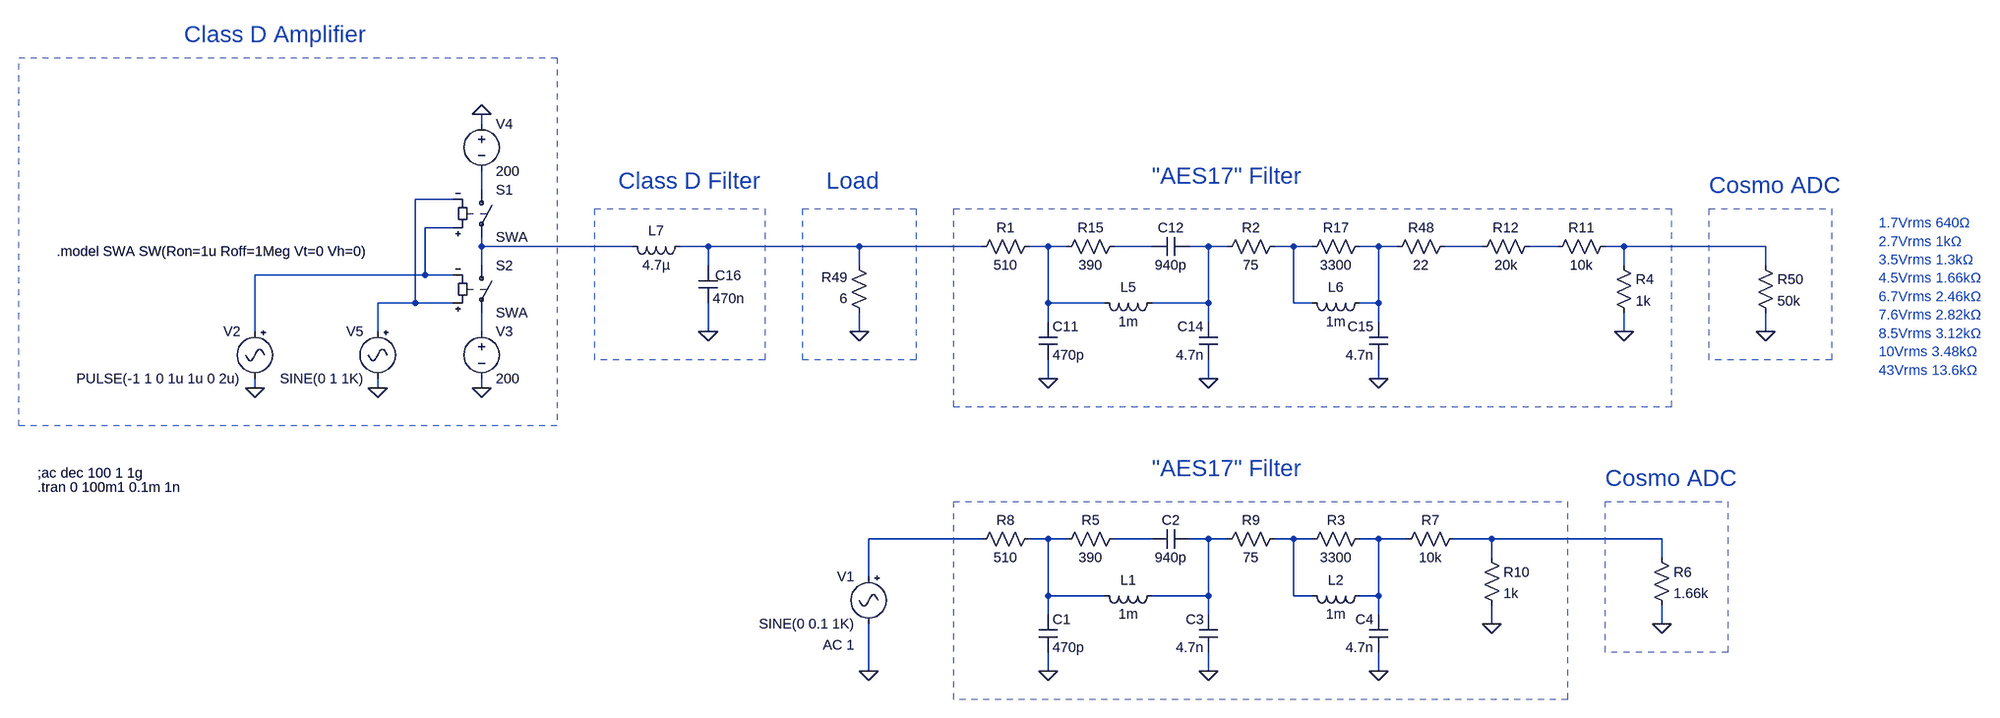
[diagram p0: schematic AES17Filter new only.asc]
AES17Filter new only.asc, the LTspice schematic file:
Version 4
SHEET 1 2936 680
WIRE -400 -1120 -400 -1136
WIRE -400 -1008 -400 -1040
WIRE -448 -992 -512 -992
WIRE -448 -944 -496 -944
WIRE -400 -912 -400 -928
WIRE -144 -912 -400 -912
WIRE -16 -912 -64 -912
WIRE 240 -912 -16 -912
WIRE 448 -912 240 -912
WIRE 560 -912 528 -912
WIRE 592 -912 560 -912
WIRE 736 -912 672 -912
WIRE 832 -912 800 -912
WIRE 864 -912 832 -912
WIRE 976 -912 944 -912
WIRE 1008 -912 976 -912
WIRE 1120 -912 1088 -912
WIRE 1152 -912 1120 -912
WIRE 1296 -912 1232 -912
WIRE 1424 -912 1376 -912
WIRE 1536 -912 1504 -912
WIRE 1776 -912 1536 -912
WIRE -400 -880 -400 -912
WIRE -16 -880 -16 -912
WIRE 240 -880 240 -912
WIRE 1536 -880 1536 -912
WIRE 1776 -880 1776 -912
WIRE -496 -864 -496 -944
WIRE -496 -864 -784 -864
WIRE -448 -864 -496 -864
WIRE -512 -816 -512 -992
WIRE -512 -816 -576 -816
WIRE -448 -816 -512 -816
WIRE 560 -816 560 -912
WIRE 656 -816 560 -816
WIRE 832 -816 832 -912
WIRE 832 -816 736 -816
WIRE 976 -816 976 -912
WIRE 1008 -816 976 -816
WIRE 1120 -816 1120 -912
WIRE 1120 -816 1088 -816
WIRE 560 -784 560 -816
WIRE 832 -784 832 -816
WIRE 1120 -784 1120 -816
WIRE -784 -768 -784 -864
WIRE -576 -768 -576 -816
WIRE -400 -768 -400 -800
WIRE -16 -768 -16 -816
WIRE 240 -768 240 -800
WIRE 1536 -768 1536 -800
WIRE 1776 -768 1776 -800
WIRE 560 -688 560 -720
WIRE 832 -688 832 -720
WIRE 1120 -688 1120 -720
WIRE -784 -672 -784 -688
WIRE -576 -672 -576 -688
WIRE -400 -672 -400 -688
WIRE 448 -416 256 -416
WIRE 560 -416 528 -416
WIRE 592 -416 560 -416
WIRE 736 -416 672 -416
WIRE 832 -416 800 -416
WIRE 864 -416 832 -416
WIRE 976 -416 944 -416
WIRE 1008 -416 976 -416
WIRE 1120 -416 1088 -416
WIRE 1168 -416 1120 -416
WIRE 1312 -416 1248 -416
WIRE 1600 -416 1312 -416
WIRE 1312 -384 1312 -416
WIRE 1600 -384 1600 -416
WIRE 256 -352 256 -416
WIRE 560 -320 560 -416
WIRE 656 -320 560 -320
WIRE 832 -320 832 -416
WIRE 832 -320 736 -320
WIRE 976 -320 976 -416
WIRE 1008 -320 976 -320
WIRE 1120 -320 1120 -416
WIRE 1120 -320 1088 -320
WIRE 560 -288 560 -320
WIRE 832 -288 832 -320
WIRE 1120 -288 1120 -320
WIRE 1312 -272 1312 -304
WIRE 1600 -272 1600 -304
WIRE 256 -192 256 -272
WIRE 560 -192 560 -224
WIRE 832 -192 832 -224
WIRE 1120 -192 1120 -224
FLAG 560 -688 0
FLAG 832 -688 0
FLAG 1120 -688 0
FLAG -400 -672 0
FLAG -400 -1136 0
FLAG -576 -672 0
FLAG -784 -672 0
FLAG -16 -768 0
FLAG 240 -768 0
FLAG 1776 -768 0
FLAG 1536 -768 0
FLAG 560 -192 0
FLAG 832 -192 0
FLAG 1120 -192 0
FLAG 1600 -272 0
FLAG 1312 -272 0
FLAG 256 -192 0
SYMBOL cap 544 -784 R0
SYMATTR InstName C11
SYMATTR Value 470p
SYMBOL cap 800 -928 R90
WINDOW 0 0 32 VBottom 2
WINDOW 3 32 32 VTop 2
SYMATTR InstName C12
SYMATTR Value 940p
SYMBOL ind 752 -832 R90
WINDOW 0 5 56 VBottom 2
WINDOW 3 32 56 VTop 2
SYMATTR InstName L5
SYMATTR Value 1m
SYMATTR SpiceLine Rser=1.4
SYMBOL cap 848 -720 R180
WINDOW 0 24 56 Left 2
WINDOW 3 24 8 Left 2
SYMATTR InstName C14
SYMATTR Value 4.7n
SYMBOL res 1104 -928 R90
WINDOW 0 0 56 VBottom 2
WINDOW 3 32 56 VTop 2
SYMATTR InstName R17
SYMATTR Value 3300
SYMBOL ind 1104 -832 R90
WINDOW 0 5 56 VBottom 2
WINDOW 3 32 56 VTop 2
SYMATTR InstName L6
SYMATTR Value 1m
SYMATTR SpiceLine Rser=1.4
SYMBOL cap 1136 -720 R180
WINDOW 0 24 56 Left 2
WINDOW 3 24 8 Left 2
SYMATTR InstName C15
SYMATTR Value 4.7n
SYMBOL res 688 -928 R90
WINDOW 0 0 56 VBottom 2
WINDOW 3 32 56 VTop 2
SYMATTR InstName R15
SYMATTR Value 390
SYMBOL sw -400 -1024 R0
SYMATTR InstName S1
SYMATTR Value SWA
SYMBOL sw -400 -896 R0
SYMATTR InstName S2
SYMATTR Value SWA
SYMBOL voltage -400 -784 R0
WINDOW 123 0 0 Left 0
WINDOW 39 0 0 Left 0
SYMATTR InstName V3
SYMATTR Value 200
SYMBOL voltage -400 -1136 R0
WINDOW 123 0 0 Left 0
WINDOW 39 0 0 Left 0
SYMATTR InstName V4
SYMATTR Value 200
SYMBOL Misc\\signal -784 -784 M0
WINDOW 123 24 132 Left 2
WINDOW 39 0 0 Left 0
SYMATTR InstName V2
SYMATTR Value PULSE(-1 1 0 1u 1u 0 2u)
SYMBOL Misc\\signal -576 -784 M0
WINDOW 123 24 132 Left 2
WINDOW 39 0 0 Left 0
SYMATTR InstName V5
SYMBOL ind -48 -928 R90
WINDOW 0 5 56 VBottom 2
WINDOW 3 32 56 VTop 2
SYMATTR InstName L7
SYMATTR Value 4.7µ
SYMATTR SpiceLine Rser=1m
SYMBOL cap -32 -880 R0
WINDOW 0 28 17 Left 2
SYMATTR InstName C16
SYMATTR Value 470n
SYMBOL res 256 -784 R180
WINDOW 0 36 76 Left 2
WINDOW 3 36 40 Left 2
SYMATTR InstName R49
SYMATTR Value 6
SYMBOL res 1760 -896 R0
SYMATTR InstName R50
SYMATTR Value 50k
SYMBOL res 1248 -928 R90
WINDOW 0 0 56 VBottom 2
WINDOW 3 32 56 VTop 2
SYMATTR InstName R48
SYMATTR Value 22
SYMBOL res 544 -928 R90
WINDOW 0 0 56 VBottom 2
WINDOW 3 32 56 VTop 2
SYMATTR InstName R1
SYMATTR Value 510
SYMBOL res 960 -928 R90
WINDOW 0 0 56 VBottom 2
WINDOW 3 32 56 VTop 2
SYMATTR InstName R2
SYMATTR Value 75
SYMBOL res 1520 -896 R0
SYMATTR InstName R4
SYMATTR Value 1k
SYMBOL cap 544 -288 R0
SYMATTR InstName C1
SYMATTR Value 470p
SYMBOL cap 800 -432 R90
WINDOW 0 0 32 VBottom 2
WINDOW 3 32 32 VTop 2
SYMATTR InstName C2
SYMATTR Value 940p
SYMBOL ind 752 -336 R90
WINDOW 0 5 56 VBottom 2
WINDOW 3 32 56 VTop 2
SYMATTR InstName L1
SYMATTR Value 1m
SYMATTR SpiceLine Rser=1.4
SYMBOL cap 848 -224 R180
WINDOW 0 24 56 Left 2
WINDOW 3 24 8 Left 2
SYMATTR InstName C3
SYMATTR Value 4.7n
SYMBOL res 1104 -432 R90
WINDOW 0 0 56 VBottom 2
WINDOW 3 32 56 VTop 2
SYMATTR InstName R3
SYMATTR Value 3300
SYMBOL ind 1104 -336 R90
WINDOW 0 5 56 VBottom 2
WINDOW 3 32 56 VTop 2
SYMATTR InstName L2
SYMATTR Value 1m
SYMATTR SpiceLine Rser=1.4
SYMBOL cap 1136 -224 R180
WINDOW 0 24 56 Left 2
WINDOW 3 24 8 Left 2
SYMATTR InstName C4
SYMATTR Value 4.7n
SYMBOL res 688 -432 R90
WINDOW 0 0 56 VBottom 2
WINDOW 3 32 56 VTop 2
SYMATTR InstName R5
SYMATTR Value 390
SYMBOL res 1584 -400 R0
SYMATTR InstName R6
SYMATTR Value 1.66k
SYMBOL res 1264 -432 R90
WINDOW 0 0 56 VBottom 2
WINDOW 3 32 56 VTop 2
SYMATTR InstName R7
SYMATTR Value 10k
SYMBOL res 544 -432 R90
WINDOW 0 0 56 VBottom 2
WINDOW 3 32 56 VTop 2
SYMATTR InstName R8
SYMATTR Value 510
SYMBOL res 960 -432 R90
WINDOW 0 0 56 VBottom 2
WINDOW 3 32 56 VTop 2
SYMATTR InstName R9
SYMATTR Value 75
SYMBOL res 1296 -400 R0
SYMATTR InstName R10
SYMATTR Value 1k
SYMBOL Misc\\signal 256 -368 M0
WINDOW 123 24 132 Left 2
WINDOW 39 0 0 Left 0
SYMATTR Value2 AC 1
SYMATTR InstName V1
SYMATTR Value SINE(0 0.1 1K)
SYMBOL res 1520 -928 R90
WINDOW 0 0 56 VBottom 2
WINDOW 3 32 56 VTop 2
SYMATTR InstName R11
SYMATTR Value 10k
SYMBOL res 1392 -928 R90
WINDOW 0 0 56 VBottom 2
WINDOW 3 32 56 VTop 2
SYMATTR InstName R12
SYMATTR Value 20k
TEXT -1152 -528 Left 2 !;ac dec 100 1 1g
TEXT -1152 -504 Left 2 !.tran 0 100m1 0.1m 1n
TEXT -1120 -904 Left 2 !.model SWA SW(Ron=1u Roff=1Meg Vt=0 Vh=0)
TEXT -904 -1272 Left 4 ;Class D Amplifier
TEXT -168 -1024 Left 4 ;Class D Filter
TEXT 184 -1024 Left 4 ;Load
TEXT 736 -1032 Left 4 ;"AES17" Filter
TEXT 1680 -1016 Left 4 ;Cosmo ADC
TEXT 1968 -952 Left 2 ;1.7Vrms 640Ω\n2.7Vrms 1kΩ\n3.5Vrms 1.3kΩ\n4.5Vrms 1.66kΩ\n6.7Vrms 2.46kΩ\n7.6Vrms 2.82kΩ\n8.5Vrms 3.12kΩ\n10Vrms 3.48kΩ\n43Vrms 13.6kΩ
TEXT 736 -536 Left 4 ;"AES17" Filter
TEXT 1504 -520 Left 4 ;Cosmo ADC
RECTANGLE Normal -272 -608 -1184 -1232 2
RECTANGLE Normal 80 -720 -208 -976 2
RECTANGLE Normal 336 -720 144 -976 2
RECTANGLE Normal 1616 -640 400 -976 2
RECTANGLE Normal 1888 -720 1680 -976 2
RECTANGLE Normal 1440 -144 400 -480 2
RECTANGLE Normal 1712 -224 1504 -480 2

The netlist it stands for:
* AES17Filter new only.asc
C11 N006 0 470p
C12 N008 N007 940p
L5 N008 N006 1m Rser=1.4
C14 0 N008 4.7n
R17 N010 N009 3300
L6 N010 N009 1m Rser=1.4
C15 0 N010 4.7n
R15 N007 N006 390
S1 N001 N004 N003 N002 SWA
S2 N004 N014 N002 N003 SWA
V3 N014 0 200
V4 0 N001 200
V2 N003 0 PULSE(-1 1 0 1u 1u 0 2u)
V5 N002 0 SINE(0 1 1K)
L7 N005 N004 4.7µ Rser=1m
C16 N005 0 470n
R49 0 N005 6
R50 N013 0 50k
R48 N011 N010 22
R1 N006 N005 510
R2 N009 N008 75
R4 N013 0 1k
C1 N016 0 470p
C2 N018 N017 940p
L1 N018 N016 1m Rser=1.4
C3 0 N018 4.7n
R3 N020 N019 3300
L2 N020 N019 1m Rser=1.4
C4 0 N020 4.7n
R5 N017 N016 390
R6 N021 0 1.66k
R7 N021 N020 10k
R8 N016 N015 510
R9 N019 N018 75
R10 N021 0 1k
V1 N015 0 SINE(0 0.1 1K) AC 1
R11 N013 N012 10k
R12 N012 N011 20k
;ac dec 100 1 1g
.tran 0 100m1 0.1m 1n
.model SWA SW(Ron=1u Roff=1Meg Vt=0 Vh=0)
* Class D Amplifier
* Class D Filter
* Load
* "AES17" Filter
* Cosmo ADC
* 1.7Vrms 640Ω
* 2.7Vrms 1kΩ
* 3.5Vrms 1.3kΩ
* 4.5Vrms 1.66kΩ
* 6.7Vrms 2.46kΩ
* 7.6Vrms 2.82kΩ
* 8.5Vrms 3.12kΩ
* 10Vrms 3.48kΩ
* 43Vrms 13.6kΩ
* "AES17" Filter
* Cosmo ADC
.backanno
.end